# Altium schematic sheet Relays.SchDoc: Relays
size A4; Engineer: M.GUENI; Organization: Altium Limited; Address1: L3, 12a Rodborough Rd; Address2: Frenchs Forest; Address3: NSW; Address4: Australia 2086; Revision: R0; SheetNumber: 3; SheetTotal: 8
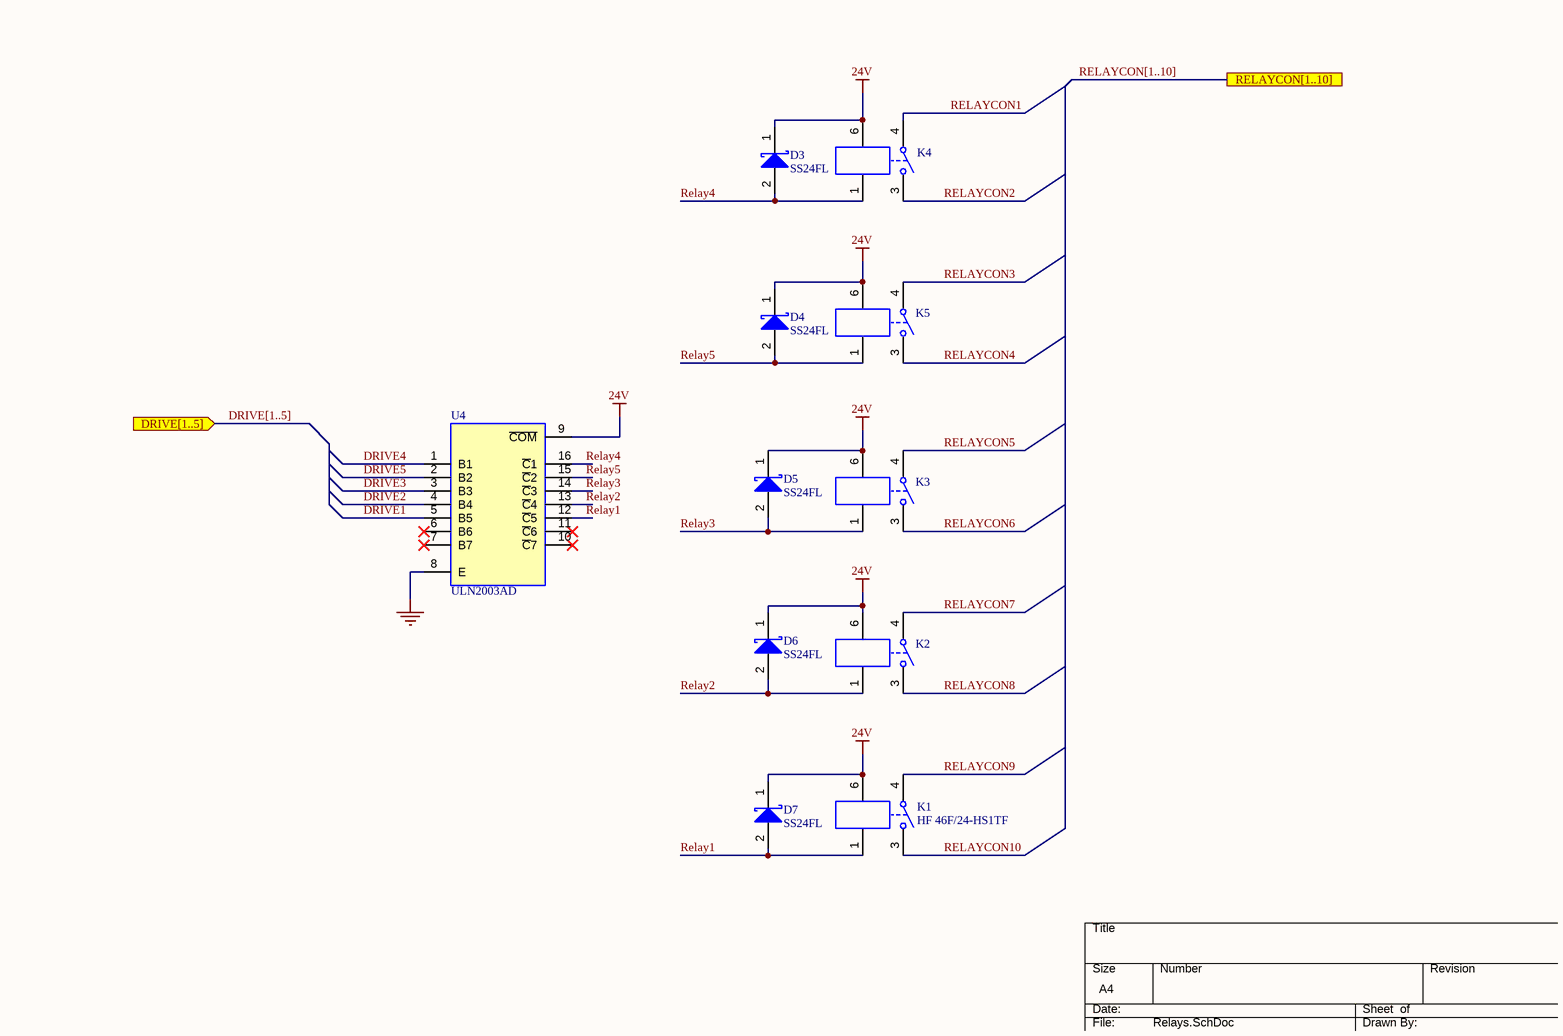
[diagram p0: Relays.SchDoc]

## Parts
D3  SS24FL  [SOD-123F]
D4  SS24FL  [SOD-123F]
D5  SS24FL  [SOD-123F]
D6  SS24FL  [SOD-123F]
D7  SS24FL  [SOD-123F]
K1  HF 46F/24-HS1TF  [G6BU-1114P]
K2  HF 46F/24-HS1TF  [G6BU-1114P]  (value not drawn)
K3  HF 46F/24-HS1TF  [G6BU-1114P]  (value not drawn)
K4  HF 46F/24-HS1TF  [G6BU-1114P]  (value not drawn)
K5  HF 46F/24-HS1TF  [G6BU-1114P]  (value not drawn)
U4  ULN2003AD  [SOIC-16]

## Ports
DRIVE[1..5] (in), RELAYCON[1..10]

## Nets
24V: D3.1(K) D4.1(K) D5.1(K) D6.1(K) D7.1(K) K1.6 K2.6 K3.6 K4.6 K5.6 U4.9(~{COM})
GND: U4.8(E)
DRIVE1: U4.5(B5)
DRIVE2: U4.4(B4)
DRIVE3: U4.3(B3)
DRIVE4: U4.1(B1)
DRIVE5: U4.2(B2)
Relay1: D7.2(A) K1.1 U4.12(~{C}5)
Relay2: D6.2(A) K2.1 U4.13(~{C}4)
Relay3: D5.2(A) K3.1 U4.14(~{C}3)
Relay4: D3.2(A) K4.1 U4.16(~{C}1)
Relay5: D4.2(A) K5.1 U4.15(~{C}2)
RELAYCON1: K4.4
RELAYCON2: K4.3
RELAYCON3: K5.4
RELAYCON4: K5.3
RELAYCON5: K3.4
RELAYCON6: K3.3
RELAYCON7: K2.4
RELAYCON8: K2.3
RELAYCON9: K1.4
RELAYCON10: K1.3

Not connected (* = marked no-connect by the designer): U4 6(B6)* 7(B7)* 10(~{C}7)* 11(~{C}6)*

## Buses and harness runs
bus DRIVE[1..5] = port DRIVE[1..5]
bus RELAYCON[1..10] = port RELAYCON[1..10]

## Notes on the sheet
- THIS DOCUMENT AND THE DATA DISCLOSED HEREIN OR
- HEREWITH IS THE PROPERTY OF ALTIUM LIMITED AND MAY
- DWG NO:
- REVISION
- REV:
- DESCRIPTION
- DATE
- APPROVED
- BE FREELY DISTRIBUTED IN WHOLE. NO RIGHTS ARE
- RESERVED OR EXPRESS OR IMPLIED WARANTEE GIVEN.
- ENG:
- APPROVALS
- PROJECT
- DSN:
- CHK:
- REFERENCE DOCUMENTS
- PROJECT REVISION:
- TITLE
- DOCUMENT REVISION:
- DESIGN ITEM:
- BOM:
- FAB DWG:
- PCB DWG:
- ASSY DWG:
- SCALE:
- A3
- SIZE
- CAGE CODE
- FILE NAME
- DWG NO.
- SHEET
- OF
- REV

## Library data of the parts
D3-D7 = DIS-000000002: MAN: ON Semiconductor / Fairchild; DES: Schottky Diodes & Rectifiers 40V, 2A SCHOTTKY; Value 1: 2A; Value 2: 40V; TOL: _; FTP: SOD-123-2; SUP: Mouser; SUPREF: 512-SS24FL; Part Number: DIS-000000002; MANREF: SS24FL; NOTE: _
K1-K5 = RLY-000000002: MAN: HONGFA RELAY; DES: Relais 24V SPST; Value 1: 5A; Value 2: 24VDC; TOL: _; FTP: THT; SUP: AGCONSEILS; Part Number: RLY-000000002; MANREF: HF 46F/24-HS1TF; SUPREF: HF 46F/24-HS1TF; NOTE: _
U4 = ICD-000000003: MAN: Texas Instruments; DES: Darlington Transistors Darlington; Value 1: _; SUP: Mouser; SUPREF: 595-ULN2003AD; Part Number: ICD-000000003; MANREF: ULN2003AD; Value 2: _; TOL: _; FTP: SOIC-16; NOTE: _